# Altium schematic sheet BSPD.SchDoc
size Tabloid; SheetNumber: 4; SheetTotal: 4
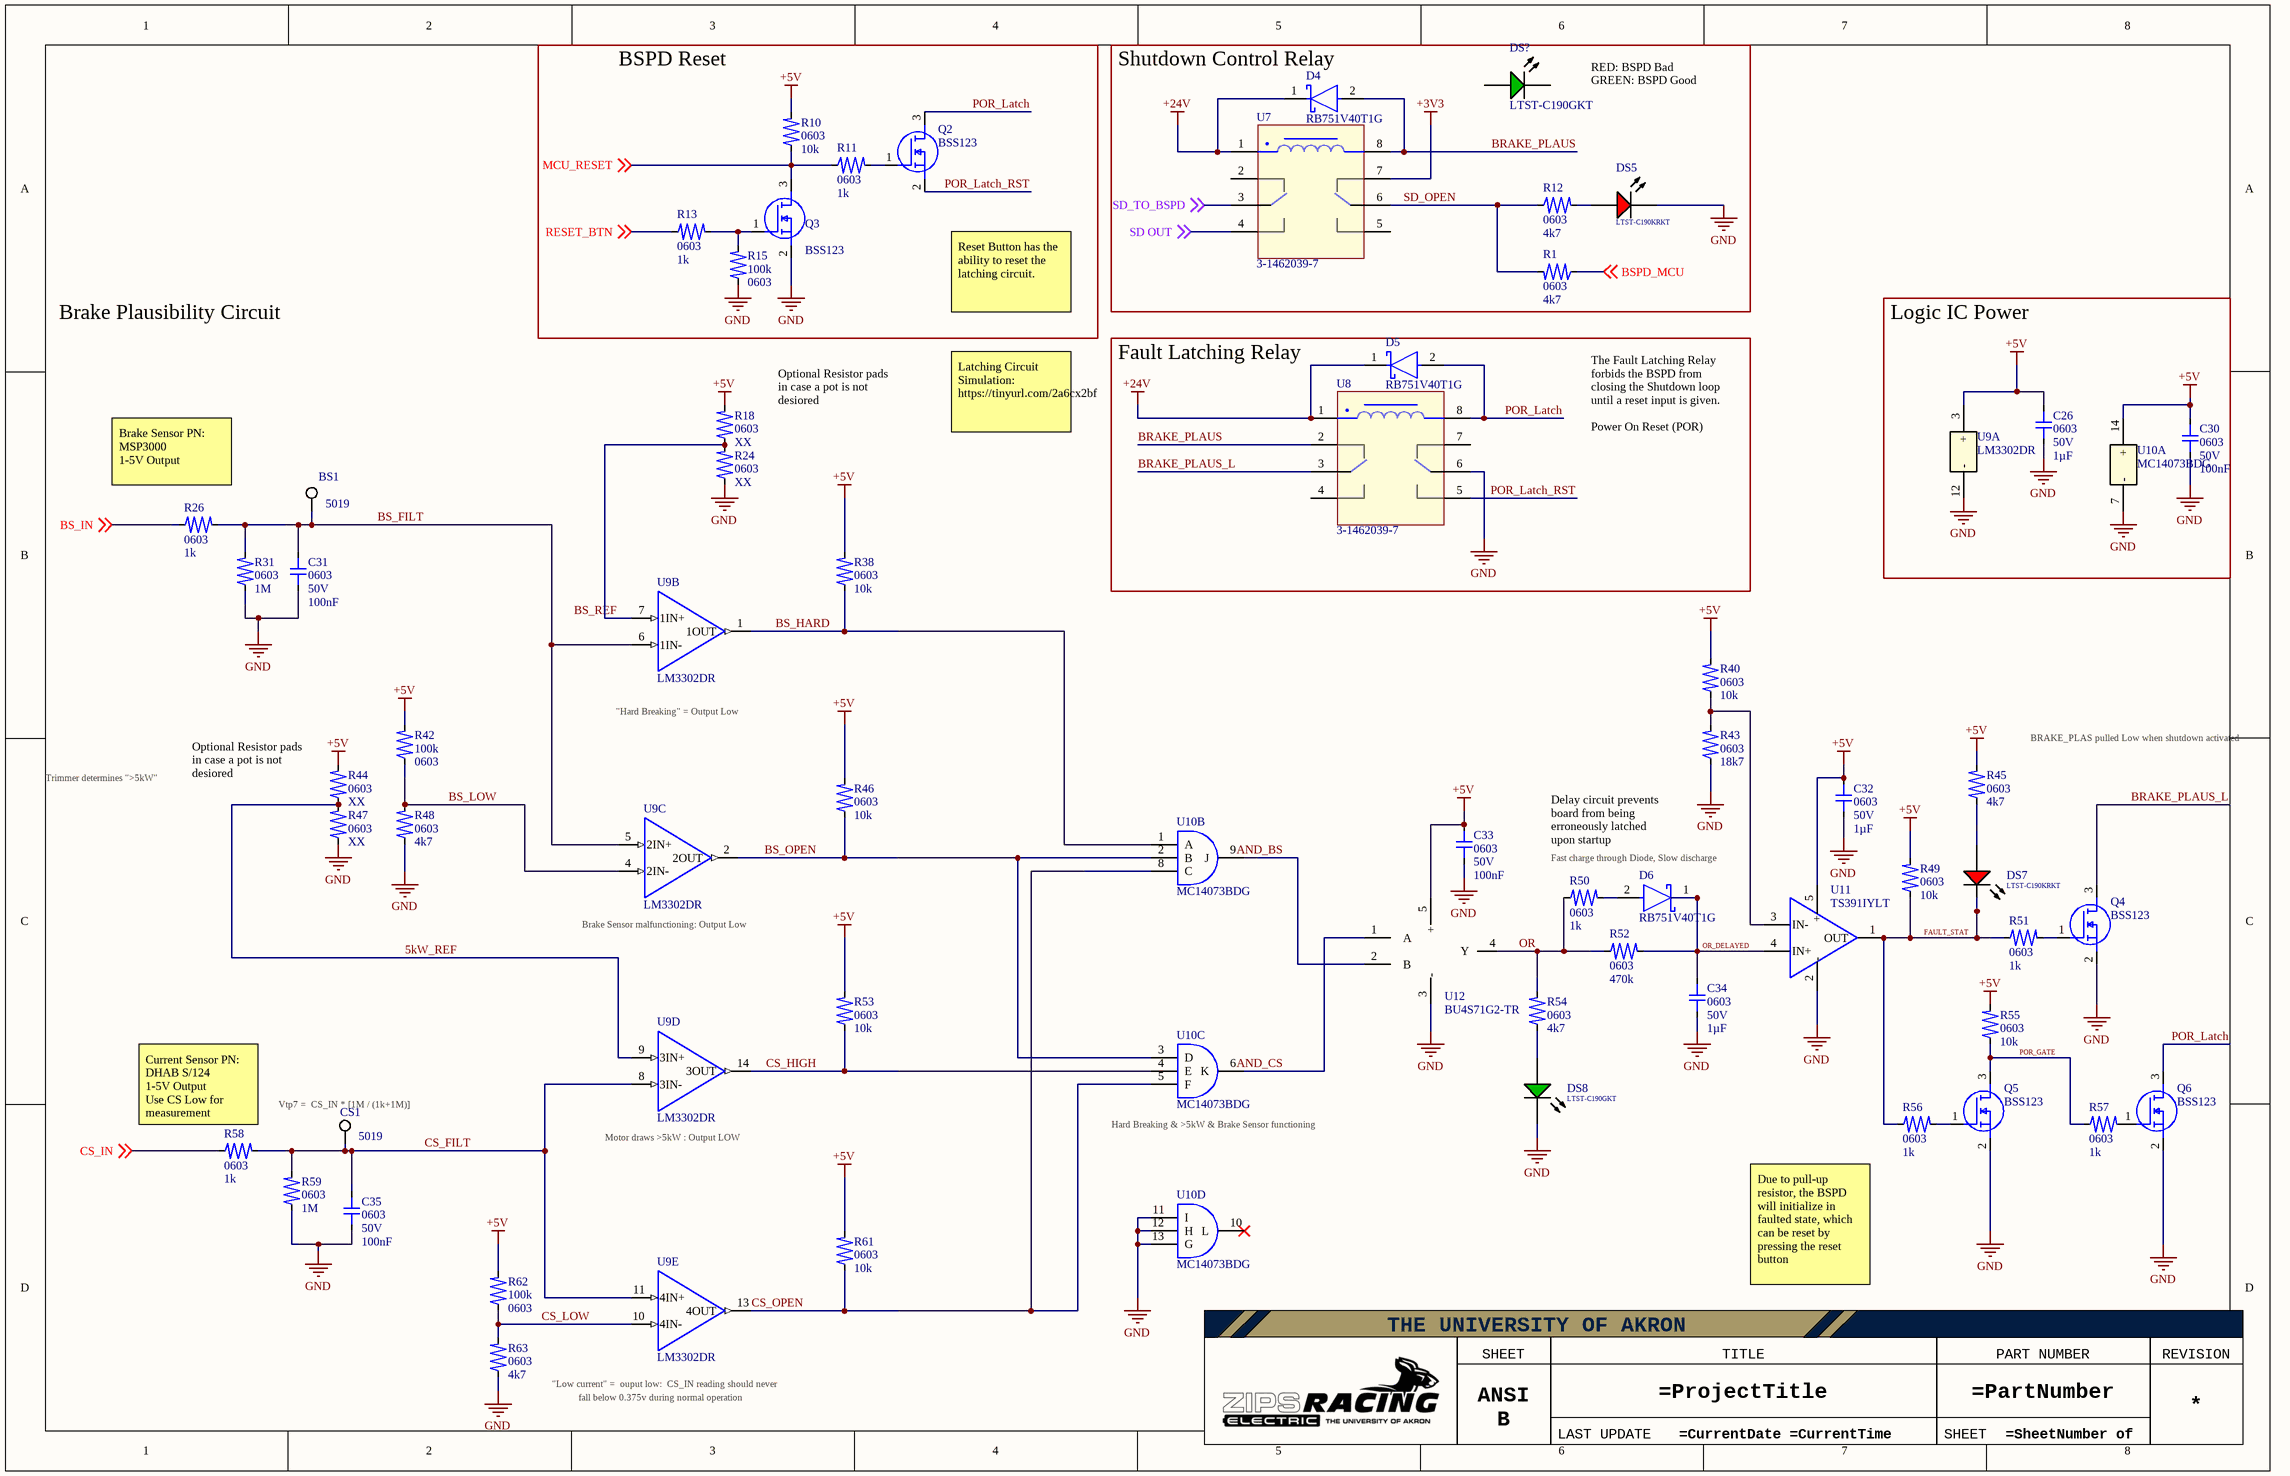
[diagram p0: BSPD.SchDoc]

## Parts
BS1  5019  [KSTN-5019_V]
C26  value 1µF  Footprint: 0603  Voltage: 50V  [CAP-0603-Generic]  (hidden comment: Capacitor 1uF 0603 5%)
C30  value 100nF  Footprint: 0603  Voltage: 50V  [CAP-0603-Generic]  (hidden comment: Capacitor 100nF 0603 5%)
C31  value 100nF  Footprint: 0603  Voltage: 50V  [CAP-0603-Generic]  (hidden comment: Capacitor 100nF 0603 5%)
C32  value 1µF  Footprint: 0603  Voltage: 50V  [CAP-0603-Generic]  (hidden comment: Capacitor 1uF 0603 5%)
C33  value 100nF  Footprint: 0603  Voltage: 50V  [CAP-0603-Generic]  (hidden comment: Capacitor 100nF 0603 5%)
C34  value 1µF  Footprint: 0603  Voltage: 50V  [CAP-0603-Generic]  (hidden comment: Capacitor 1uF 0603 5%)
C35  value 100nF  Footprint: 0603  Voltage: 50V  [CAP-0603-Generic]  (hidden comment: Capacitor 100nF 0603 5%)
CS1  5019  [KSTN-5019_V]
D4  RB751V40T1G  [FP-477-02-MFG]
D5  RB751V40T1G  [FP-477-02-MFG]
D6  RB751V40T1G  [FP-477-02-MFG]
DS5  LTST-C190KRKT  [LTST-C191KRKT_V]
DS7  LTST-C190KRKT  [LTST-C191KRKT_V]
DS8  LTST-C190GKT  [LTST-C190GKT_V]
DS?  LTST-C190GKT  [LTST-C190GKT_V]
Q2  BSS123  [SOT96P237X111-3N]
Q3  BSS123  [SOT96P237X111-3N]
Q4  BSS123  [SOT96P237X111-3N]
Q5  BSS123  [SOT96P237X111-3N]
Q6  BSS123  [SOT96P237X111-3N]
R1  value 4k7  Footprint: 0603  [RES-0603-Generic]  (hidden comment: Resistor 4k7 0603 1%)
R10  value 10k  Footprint: 0603  [RES-0603-Generic]  (hidden comment: Resistor 10k 0603 1%)
R11  value 1k  Footprint: 0603  [RES-0603-Generic]  (hidden comment: Resistor 1k 0603 1%)
R12  value 4k7  Footprint: 0603  [RES-0603-Generic]  (hidden comment: Resistor 4k7 0603 1%)
R13  value 1k  Footprint: 0603  [RES-0603-Generic]  (hidden comment: Resistor 1k 0603 1%)
R15  value 100k  Footprint: 0603  [RES-0603-Generic]  (hidden comment: Resistor 100k 0603 1%)
R18  value XX  Footprint: 0603  [RES-0603-Generic]  (hidden comment: Resistor XX 0603 1%)
R24  value XX  Footprint: 0603  [RES-0603-Generic]  (hidden comment: Resistor XX 0603 1%)
R26  value 1k  Footprint: 0603  [RES-0603-Generic]  (hidden comment: Resistor 1k 0603 1%)
R31  value 1M  Footprint: 0603  [RES-0603-Generic]  (hidden comment: Resistor 1M 0603 1%)
R38  value 10k  Footprint: 0603  [RES-0603-Generic]  (hidden comment: Resistor 10k 0603 1%)
R40  value 10k  Footprint: 0603  [RES-0603-Generic]  (hidden comment: Resistor 10k 0603 1%)
R42  value 100k  Footprint: 0603  [RES-0603-Generic]  (hidden comment: Resistor 100k 0603 1%)
R43  value 18k7  Footprint: 0603  [RES-0603-Generic]  (hidden comment: Resistor 10k 0603 1%)
R44  value XX  Footprint: 0603  [RES-0603-Generic]  (hidden comment: Resistor XX 0603 1%)
R45  value 4k7  Footprint: 0603  [RES-0603-Generic]  (hidden comment: Resistor 4k7 0603 1%)
R46  value 10k  Footprint: 0603  [RES-0603-Generic]  (hidden comment: Resistor 10k 0603 1%)
R47  value XX  Footprint: 0603  [RES-0603-Generic]  (hidden comment: Resistor XX 0603 1%)
R48  value 4k7  Footprint: 0603  [RES-0603-Generic]  (hidden comment: Resistor 4k7 0603 1%)
R49  value 10k  Footprint: 0603  [RES-0603-Generic]  (hidden comment: Resistor 10k 0603 1%)
R50  value 1k  Footprint: 0603  [RES-0603-Generic]  (hidden comment: Resistor 1k 0603 1%)
R51  value 1k  Footprint: 0603  [RES-0603-Generic]  (hidden comment: Resistor 1k 0603 1%)
R52  value 470k  Footprint: 0603  [RES-0603-Generic]  (hidden comment: Resistor 470k 0603 1%)
R53  value 10k  Footprint: 0603  [RES-0603-Generic]  (hidden comment: Resistor 10k 0603 1%)
R54  value 4k7  Footprint: 0603  [RES-0603-Generic]  (hidden comment: Resistor 4k7 0603 1%)
R55  value 10k  Footprint: 0603  [RES-0603-Generic]  (hidden comment: Resistor 10k 0603 1%)
R56  value 1k  Footprint: 0603  [RES-0603-Generic]  (hidden comment: Resistor 1k 0603 1%)
R57  value 1k  Footprint: 0603  [RES-0603-Generic]  (hidden comment: Resistor 1k 0603 1%)
R58  value 1k  Footprint: 0603  [RES-0603-Generic]  (hidden comment: Resistor 1k 0603 1%)
R59  value 1M  Footprint: 0603  [RES-0603-Generic]  (hidden comment: Resistor 1M 0603 1%)
R61  value 10k  Footprint: 0603  [RES-0603-Generic]  (hidden comment: Resistor 10k 0603 1%)
R62  value 100k  Footprint: 0603  [RES-0603-Generic]  (hidden comment: Resistor 100k 0603 1%)
R63  value 4k7  Footprint: 0603  [RES-0603-Generic]  (hidden comment: Resistor 4k7 0603 1%)
U7  3-1462039-7  [3-1462039-7-Footprint-1]
U8  3-1462039-7  [3-1462039-7-Footprint-1]
U9  LM3302DR  [SOIC127P600X175-14N]  (parts A,B,C,D,E of 5)
U10  MC14073BDG  [MC14073BDG-Footprint-1]  (parts A,B,C,D of 4)
U11  TS391IYLT  [SOT23-5_STM]
U12  BU4S71G2-TR  [SSOP5_ROM-L]

## Blocks framed on the sheet
BSPD Reset: Q2 Q3 R10 R11 R13 R15
Shutdown Control Relay: D4 DS5 DS? R1 R12 U7
Logic IC Power: C26 C30 U9 U10
Fault Latching Relay: D5 U8

## Nets
+3V3: U7.7
+5V: C26.2 C30.2 C32.2 C33.2 R10.2 R18.2 R38.2 R40.2 R42.2 R44.2 R45.2 R46.2 R49.2 R53.2 R55.2 R61.2 R62.2 U9.3(+) U10.14(+) U11.5(+) U12.5(+)
+24V: D4.1(C) D5.1(C) U7.1 U8.1
GND: C26.1 C30.1 C31.1 C32.1 C33.1 C34.1 C35.1 DS5.2(K) DS8.2(K) Q3.2(S) Q4.2(S) Q5.2(S) Q6.2(S) R15.1 R24.1 R31.1 R43.1 R47.1 R48.1 R59.1 R63.1 U8.6 U9.12(-) U10.7(-) U10.11(I) U10.12(H) U10.13(G) U11.2(-) U12.3(-)
5kW_REF: R44.1 R47.2 U9.9(3IN+)
AND_BS: U10.9(J) U12.2(B)
AND_CS: U10.6(K) U12.1(A)
BRAKE_PLAUS: D4.2(A) U7.8 U8.2
BRAKE_PLAUS_L: Q4.3(D) U8.3
BS_FILT: BS1.1 C31.2 R26.2 R31.2 U9.5(2IN+) U9.6(1IN-)
BS_HARD: R38.1 U9.1(1OUT) U10.1(A)
BS_IN: R26.1 ; off-sheet BS_IN
BS_LOW: R42.1 R48.2 U9.4(2IN-)
BS_OPEN: R46.1 U9.2(2OUT) U10.2(B) U10.3(D)
BS_REF: R18.1 R24.2 U9.7(1IN+)
BSPD_MCU: R1.1 ; off-sheet BSPD_MCU
CS_FILT: C35.2 CS1.1 R58.2 R59.2 U9.8(3IN-) U9.11(4IN+)
CS_HIGH: R53.1 U9.14(3OUT) U10.4(E)
CS_IN: R58.1 ; off-sheet CS_IN
CS_LOW: R62.1 R63.2 U9.10(4IN-)
CS_OPEN: R61.1 U9.13(4OUT) U10.5(F) U10.8(C)
FAULT_STAT: DS7.2(K) R49.1 R51.1 R56.1 U11.1(OUT)
MCU_RESET: Q3.3(D) R10.1 R11.1 ; off-sheet MCU_RESET
OR: R50.1 R52.1 R54.2 U12.4(Y)
OR_DELAYED: C34.2 D6.1(C) R52.2 U11.4(IN+)
POR_GATE: Q5.3(D) R55.1 R57.1
POR_Latch: D5.2(A) Q2.3(D) Q6.3(D) U8.8
POR_Latch_RST: Q2.2(S) U8.5
RESET_BTN: R13.1 ; off-sheet RESET_BTN
SD OUT: U7.4 ; off-sheet SD OUT
SD_OPEN: R1.2 R12.1 U7.6
SD_TO_BSPD: U7.3 ; off-sheet SD_TO_BSPD
NetD6_2: D6.2(A) R50.2
NetDS5_1: DS5.1(A) R12.2
NetDS7_1: DS7.1(A) R45.1
NetDS8_1: DS8.1(A) R54.1
NetQ2_1: Q2.1(G) R11.2
NetQ3_1: Q3.1(G) R13.2 R15.2
NetQ4_1: Q4.1(G) R51.2
NetQ5_1: Q5.1(G) R56.2
NetQ6_1: Q6.1(G) R57.2
NetR40_1: R40.1 R43.2 U11.3(IN-)

Not connected (* = marked no-connect by the designer): DS? 1(A) 2(K); U7 2 5; U8 4 7; U10 10(L)*

## Notes on the sheet
- RED: BSPD Bad
  GREEN: BSPD Good
- Brake Plausibility Circuit
- Reset Button has the ability to reset the latching circuit.
- Optional Resistor pads in case a pot is not desiored
- Latching Circuit Simulation:
  https://tinyurl.com/2a6cx2bf
- The Fault Latching Relay forbids the BSPD from closing the Shutdown loop until a reset input is given.
- (near R26) Brake Sensor PN:
  MSP3000
  1-5V Output
- Power On Reset (POR)
- "Hard Breaking" = Output Low
- BRAKE_PLAS pulled Low when shutdown activated
- Trimmer determines ">5kW"
- Fast charge through Diode, Slow discharge
- Delay circuit prevents board from being erroneously latched upon startup
- (near U9) Brake Sensor malfunctioning: Output Low
- (near CS1) Vtp7 =  CS_IN * [1M / (1k+1M)]
- (near R58) Current Sensor PN:
  DHAB S/124
  1-5V Output
  Use CS Low for measurement
- (near U9) Motor draws >5kW : Output LOW
- (near U10) Hard Breaking & >5kW & Brake Sensor functioning
- (near R56) Due to pull-up resistor, the BSPD will initialize in faulted state, which can be reset by pressing the reset button
- "Low current" =  ouput low:  CS_IN reading should never
- fall below 0.375v during normal operation
- THE UNIVERSITY OF AKRON
- SHEET SIZE
- TITLE
- PART NUMBER
- REVISION
- ANSI B
- LAST UPDATE
- SHEET
- (in symbol CMP-008-00016-1) .

## Library data of the parts
BS1 CS1 = CMP-00012-1: Interconnection Device
C26 C32 C34 = CMP-00043-1: Capacitor, 0603, 5%; Min Operating Temperature: -55°C; Max Operating Temperature: 85°C
C30 C31 C33 C35 = CMP-00030-2: Capacitor, 0603, 5%; Max Operating Temperature: 125°C; Min Operating Temperature: -55°C
D4-D6 = CMP-004-00075-1: Rectifier Diode, Schottky, 1 Phase, 1 Element, 0.03A, 40V V(RRM), Silicon; Forward Voltage: 370mV; Pins: 2; RoHS Compliant: Yes; Max Operating Temperature: 150°C; Min Operating Temperature: -55°C
DS5 DS7 = CMP-007-00024-2: LED Uni-Color Red, 62.5 mW, 25 mA, -30 to 85 degC, 2-Pin SMD, RoHS, Tape and Reel; Manufacturer: Lite-On; Power: 75mW; Forward Voltage: 2V; Luminous Intensity: 54mcd; Lens Style: Diffused; Viewing Angle: 130degrees; Forward Current: 20mA; Manufacturer URL: http://www.us.liteon.com/; Case/Package: 0603; Datasheet Version: Rev. F, 05/2013; Package Reference: C191KRKT; Datasheet URL: http://optoelectronics.liteon.com/upload/download/DS-22-99-0151/S_110_LTST-C190KRKT.pdf; Package Description: 2-Pin Surface Mount Device, Body 1.6 x 0.8 mm; Nominal Vf: 2V; Packaging: TapeandReel; RoHS Compliant: True; Pins: 2; Illumination Colour: Red; Colour: Red; Mounting Technology: SM; Package Quantity: 3000; Min Operating Temperature: -55°C; Max Operating Temperature: 85°C
DS8 DS? = CMP-007-00022-2: LED Uni-Color Green, 100 mW, 30 mA, -55 to 85 degC, 2-Pin SMD, RoHS, Tape and Reel; Manufacturer: Lite-On; Power: 100mW; Forward Voltage: 2.1V; Viewing Angle: 130degrees; Forward Current: 20mA; Luminous Intensity: 6mcd; Lens Style: Clear; Manufacturer URL: http://www.us.liteon.com/; RoHS Compliant: True; Colour: Green; Package Description: 2-Pin Surface Mount Device, Body 1.6 x 0.8 mm; Datasheet URL: http://datasheet.octopart.com/LTST-C190GKT-Lite-On-datasheet-158530.pdf; Datasheet Version: Dec-06; Mounting Technology: SM; Case/Package: 0603; Package Reference: C190GKT; Packaging: TapeandReel; Min Operating Temperature: -55°C; Nominal Vf: 2.1V; Package Quantity: 3000; Illumination Colour: Green; Max Operating Temperature: 85°C; Pins: 2
Q2-Q6 = CMP-023-000002-1: MOSFET N-CH 100V 170MA SOT23-3; Manufacturer_Name: ON Semiconductor; Datasheet Link: http://uk.rs-online.com/web/p/products/6710321; Mouser Price/Stock: https://www.mouser.co.uk/ProductDetail/ON-Semiconductor-Fairchild/BSS123?qs=FOlmdCx%252BAA2Kf8SEB3qLYA%3D%3D; Arrow Part Number: BSS123; Arrow Price/Stock: https://www.arrow.com/en/products/bss123/on-semiconductor; Manufacturer_Part_Number: BSS123; Source: Zips_Racing_Electric.SchLib; Design Item ID: BSS123; Height: 1.11mm; Mouser Part Number: 512-BSS123
R1 R12 R45 R48 R54 R63 = CMP-00023-3: Resistor, 0603, 1%, 1/10W; Power: 100mW; Tolerance: 1%; Datasheet: https://www.seielect.com/catalog/sei-rmcf_rmcp.pdf; Max Operating Temperature: 155°C; Min Operating Temperature: -55°C
R10 R38 R40 R43 R46 R49 R53 R55 R61 = CMP-00020-12: Resistor, 0603, 10k; Power: 100mW; Minimum Operating Temperature: -55°C; Tolerance: 1%; Maximum Operating Temperature: 155°C; Max Operating Temperature: 155°C; Min Operating Temperature: -55°C; Datasheet: https://www.seielect.com/catalog/sei-rmcf_rmcp.pdf
R11 R13 R26 R50 R51 R56-R58 = CMP-00021-7: Resistor, 0603, 1k; Power: 100mW; Max Operating Temperature: 155°C; Min Operating Temperature: -55°C; Datasheet: https://www.seielect.com/catalog/sei-rmcf_rmcp.pdf; Tolerance: 1%
R15 R42 R62 = CMP-00052-1: Resistor, 0603, 1%, 1/10W; Power: 100mW; Min Operating Temperature: -55°C; Tolerance: 1%; Max Operating Temperature: 155°C; Datasheet: https://www.seielect.com/catalog/sei-rmcf_rmcp.pdf
R18 R24 R44 R47 = CMP-00039-1: Resistor, 0603, XX; Power: 100mW; Min Operating Temperature: -55°C; Max Operating Temperature: 155°C; Tolerance: 1%; Datasheet: https://www.seielect.com/catalog/sei-rmcf_rmcp.pdf
R31 R59 = CMP-00041-2: Resistor, 0603, 1%, 1/10W; Power: 100mW; Tolerance: 1%; Datasheet: https://www.seielect.com/catalog/sei-rmcf_rmcp.pdf; Max Operating Temperature: 155°C; Min Operating Temperature: -55°C
R52 = CMP-00018-2: Resistor, 0603, 1%, 1/10W; Power: 100mW; Min Operating Temperature: -55°C; Tolerance: 1%; Datasheet: https://www.seielect.com/catalog/sei-rmcf_rmcp.pdf; Max Operating Temperature: 155°C
U7 U8 = CMP-008-00016-1: RF Relay, DPDT, Momentary, 0.008A (Coil), 24VDC (Coil), 200mW (Coil), 5A (Contact), 220VDC (Contact), 900MHz, 60W (RF Input), DC Input, AC/DC Output, Surface Mount-Straight; Operate Time: 8ms; Min Operating Temperature: -40°C; Mounting Technology: Surface Mount; Max Operating Temperature: 85°C; RoHS Compliant: Yes
U9 = CMP-033-000000-2: Quad, General Purpose Differential Comparator; MF: Texas Instruments; Design Item ID: LM3302DR; SnapEDA_Link: https://www.snapeda.com/parts/LM3302DR/Texas+Instruments/view-part/?ref=snap; Component Type: Standard; Pin Count: 14; Price: None; Value: *; Check_prices: https://www.snapeda.com/parts/LM3302DR/Texas+Instruments/view-part/?ref=eda; Purchase-URL: https://pricing.snapeda.com/search/part/LM3302DR/?ref=eda; Package: SOIC-14 Texas Instruments; MP: LM3302DR; Source: LM3302DR.SchLib; Availability: In Stock
U10 = CMP-016-00011-1: MC14073BDG; Triple 3-Input AND Logic Gate; 3 - 18 V; 14-Pin SOIC; Max Supply Voltage: 18V; Min Supply Voltage: 3V; Logic Function: AND GATE; Low Level Output Current: 4.2mA; Number of Circuits: 3; High Level Output Current: -4.2mA; Length: 8.75mm; Lead Free: Lead Free; Max Operating Temperature: 125°C; Height: 1.5mm; Mounting Technology: Surface Mount; Case/Package: SOIC; Min Operating Temperature: -55°C
U11 = CMP-031-00010-1: Comparator General Purpose CMOS, DTL, ECL, Open-Collector, TTL SOT-23-5; Mfr_Name: STMicroelectronics; Copyright: Copyright (C) 2021 Ultra Librarian. All rights reserved.; Source: Zips_Racing_Electric.SchLib; Design Item ID: TS391IYLT; Manufacturer_Part_Number: TS391IYLT; Digi-Key_Part_Number_2: 497-10245-2-ND; Type: DEV; Digi-Key_Part_Number_1: 497-10245-1-ND; RefDes: RefDes; Digi-Key_Part_Number_3: 497-10245-6-ND
U12 = CMP-031-00013-2: IC GATE OR 1CH 2-INP 5SSOP; SourceLibrary: ROHM_2019-10-21; Vendor: ROHM Semiconductor; Built_By: EMA_Molly; Min Supply Voltage: 3V; Max Supply Voltage: 16V; RefDes: RefDes; Copyright: Copyright (C) 2018 Accelerated Designs. All rights reserved; Type: DEV; Case/Package: LSSOP; Source: Zips_Racing_Electric.SchLib; Design Item ID: BU4S71G2-TR; Manufacturer_Part_Number: BU4S71G2-TR; Min Operating Temperature: -40°C; RoHS Compliant: Yes; Pins: 5; Max Operating Temperature: 85°C